# Altium project Vreg_Learning_Platform.PrjPcb (part 2 of 4)

## Sheet Input.SchDoc: <Project Name>
size A3; ApprovedBy: <Appr.>; Author: <Author>; CompanyName: Infineon Technologies AG; Engineer: <Rel.>; Organization: Infineon Technologies AG; Address1: IFAG DES S PS; Address2: Am Campeon 1-12  -  85579 Neubiberg  -  Germany; Address3: 85579 Neubiberg; Address4: Germany; DocumentNumber: 3; Revision: <Rev.>; SheetNumber: 3; SheetTotal: 9; Release: RC00; PageSetup: Record=PageOptions|CenterHorizontal=True|CenterVertical=True|PrintScale=1.01|XCorrection=1.00|YCorrection=1.00|PrintKind=0|BorderSize=5000000|LeftOffset=0|BottomOffset=0|Orientation=2|PaperLength=1000|PaperWidth=1000|Scale=100|PaperSource=7|PrintQuality=-4|MediaType=1|DitherType=10|PaperKind=A3|PrintScaleMode=1; Doc_ConfidentialStatus: <Doc_ConfidentialStatus>; Doc_Preliminary: <Doc_Preliminary>
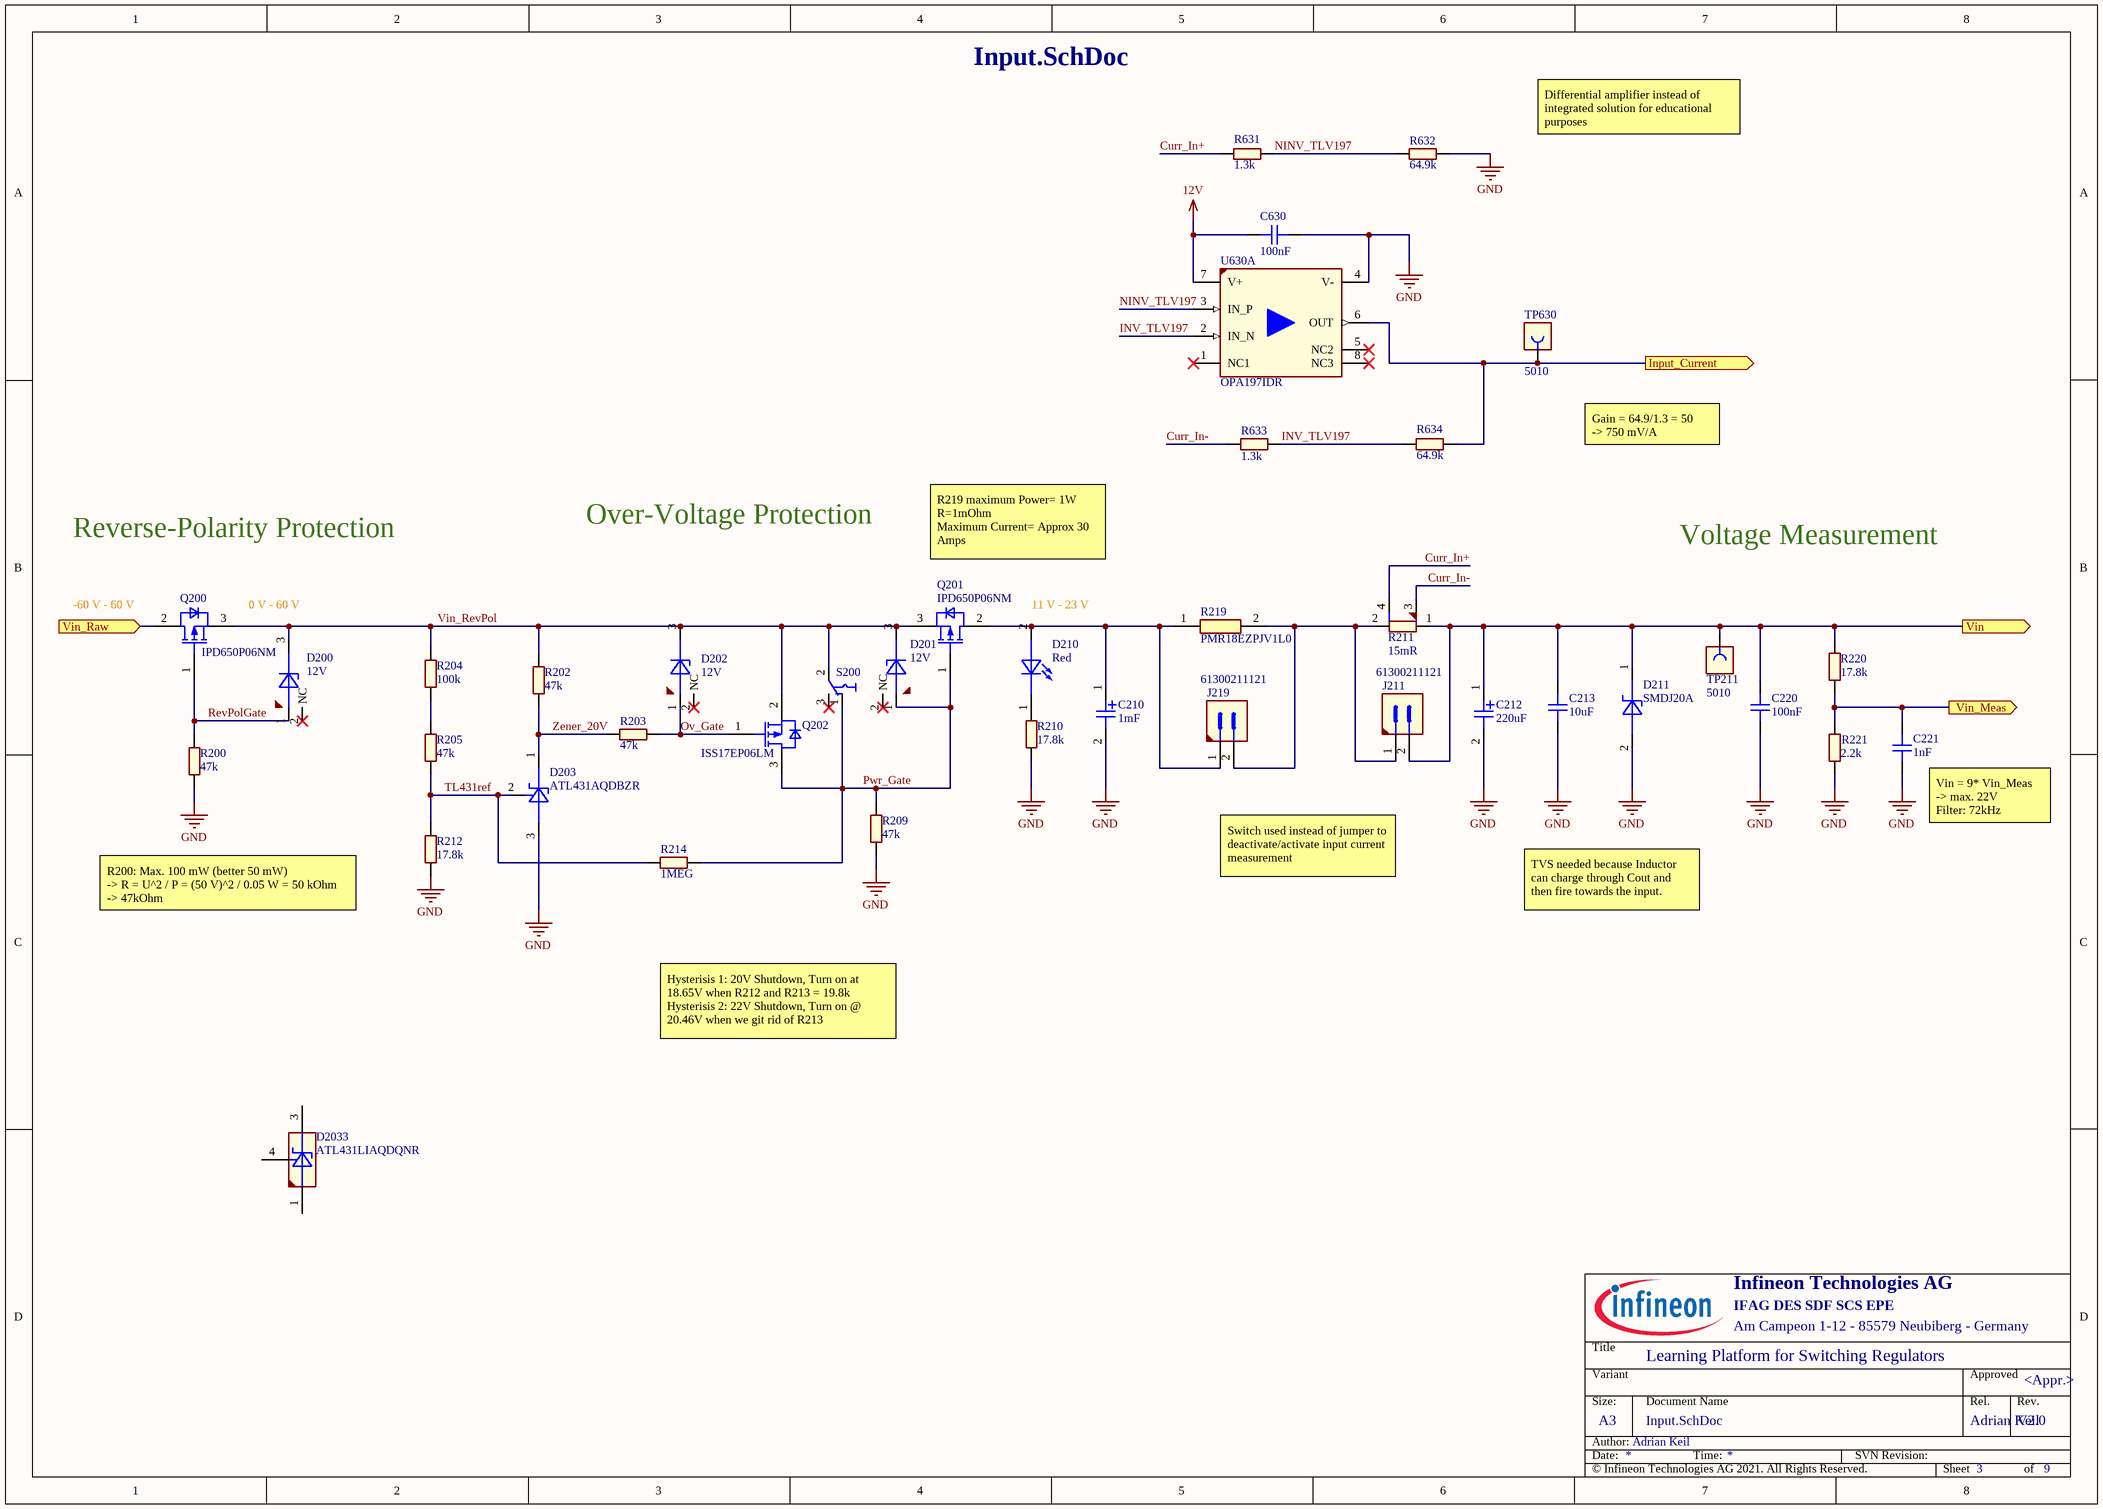
[diagram p1: Input.SchDoc]

### Parts
C210  1mF  [CAPPRD500W60D1300H2700B]
C212  220uF  [CAPAE1030X1050N-3]
C213  10uF  [CAPC3216X190N-1]
C220  100nF  [CAPC3216X125N-0]
C221  1nF  [CAPC3216X95N]
C630  100nF  [CAPC3216X125N-0]
D200  12V  [SOT95P230X110-3N]
D201  12V  [SOT95P230X110-3N]
D202  12V  [SOT95P230X110-3N]
D203  ATL431AQDBZR  [SOT95P237X112-3N-1]
D210  Red  [LEDSC160X80X80-2N-1]
D211  SMDJ20A  [DIOM7959X262N]
D2033  ATL431LIAQDQNR  [TI-SMD-X2SON-V]
J211  61300211121  [CON-M-THT-61300211121]
J219  61300211121  [CON-M-THT-61300211121]
Q200  IPD650P06NM  [TO228P998X250-3N-V2]
Q201  IPD650P06NM  [TO228P998X250-3N-V2]
Q202  ISS17EP06LM  [SOT95P240X110-3N-1-V]
R200  47k  [RESC3216X60N]
R202  47k  [RESC3216X60N]
R203  47k  [RESC3216X60N]
R204  100k  [RESC3216X60N]
R205  47k  [RESC3216X60N]
R209  47k  [RESC3216X60N]
R210  17.8k  [RESC3216X60N]
R211  15mR  [RES-SMD-L4T12]
R212  17.8k  [RESC3216X60N]
R214  1MEG  [RESC3216X60N]
R219  PMR18EZPJV1L0  [RESC3216X59N]
R220  17.8k  [RESC3216X60N]
R221  2.2k  [RESC3216X60N]
R631  1.3k  [RESC3216X60N]
R632  64.9k  [RESC3216X60N]
R633  1.3k  [RESC3216X60N]
R634  64.9k  [RESC3216X60N]
S200  CL-SB-12A-01T  [SW-SMD-CL-SB-12A-01T]  (value not drawn)
TP211  5010  [CON-THT-TP-5010]
TP630  5010  [CON-THT-TP-5010]
U630  OPA197IDR  [SOIC127P600X175-8N-23]  (part A of 2)

### Ports
Input_Current (out), Vin (out), Vin_Meas (out), Vin_Raw (in)

### Nets
12V: C630.2 U630.7(V+)
GND: C210.2 C212.2 C213.1 C220.2 C221.1 C630.1 D203.3(ANODE) D211.2(ANODE) R200.1 R209.1 R210.2 R212.2 R221.2 R632.2 U630.4(V-)
Curr_In+: R211.4(I2) R631.1
Curr_In-: R211.3(I1) R633.1
Input_Current: R634.2 TP630.1 U630.6(OUT) ; port Input_Current
INV_TLV197: R633.2 R634.1 U630.2(IN_N)
NINV_TLV197: R631.2 R632.1 U630.3(IN_P)
Ov_Gate: D202.1(ANODE) Q202.1(GATE) R203.1
Pwr_Gate: D201.1(ANODE) Q201.1(GATE) Q202.3(DRAIN) R209.2 R214.2 S200.1
RevPolGate: D200.1(ANODE) Q200.1(GATE) R200.2
TL431ref: D203.2(REF) R205.1 R212.1 R214.1
Vin: C212.1 C213.2 C220.1 D211.1(CATHODE) J211.2 R211.1(V1) R220.1 TP211.1 ; port Vin
Vin_Meas: C221.2 R220.2 R221.1 ; port Vin_Meas
Vin_RevPol: D200.3(CATHODE) D201.3(CATHODE) D202.3(CATHODE) Q200.3(SOURCE) Q201.3(SOURCE) Q202.2(SOURCE) R202.2 R204.1 S200.2
Zener_20V: D203.1(CATHODE) R202.1 R203.2
NetC210_1: C210.1 D210.2(Anode) J219.1 Q201.2(DRAIN) R219.1
NetD210_1: D210.1(Cathode) R210.1
NetJ211_1: J211.1 J219.2 R211.2(V2) R219.2
NetQ200_2: Q200.2(DRAIN) ; port Vin_Raw
NetR204_2: R204.2 R205.2

Not connected (* = marked no-connect by the designer): D200 2(NC)*; D201 2(NC)*; D202 2(NC)*; D2033 1(A) 2(NC) 3(C) 4(REF) 5(EP); S200 3*; U630 1(NC1)* 5(NC2)* 8(NC3)*

### Notes on the sheet
- Differential amplifier instead of integrated solution for educational purposes
- Gain = 64.9/1.3 = 50
  -> 750 mV/A
- Reverse-Polarity Protection
- Over-Voltage Protection
- R219 maximum Power= 1W
  R=1mOhm
  Maximum Current= Approx 30 Amps
- Voltage Measurement
- (near Q200) -60 V - 60 V
- 0 V - 60 V
- (near D210) 11 V - 23 V
- (near C221) Vin = 9* Vin_Meas
  -> max. 22V
  Filter: 72kHz
- R200: Max. 100 mW (better 50 mW)
  -> R = U^2 / P = (50 V)^2 / 0.05 W = 50 kOhm
  -> 47kOhm
- Switch used instead of jumper to deactivate/activate input current measurement
- TVS needed because Inductor can charge through Cout and then fire towards the input.
- Hysterisis 1: 20V Shutdown, Turn on at 18.65V when R212 and R213 = 19.8k
  Hysterisis 2: 22V Shutdown, Turn on @ 20.46V when we git rid of R213
- Title
- Variant
- Approved
- Date:
- Author:
- Size:
- A3
- Document Name
- Time:
- SVN Revision:
- Rel.
- Rev.
- Sheet
- of

### Library data of the parts
C210 = 646789: CAP / ELCO / 1mF / 35V / 20% / Aluminiumelectrolytic / -40°C to 105°C / 5.00mm C X 0.60mm W 13.00mm Dia X 27.00mm H / - / -; Multible Parts: No; Manufacturer: Kemet; Manufacturer Order Number: ESY108M035AL4AA; Symbol Type: Capacitor; Single; Polarized; 2 Pins; Pin 1 Positive; Alternate View: Yes; Article Number: 646789; Version Number: V01; Combined Parameters: TC:Aluminiumelectrolytic;Tol.:-20%/+20%;Vdc:35V; QuickPick: 1mF / 35V / 20% / Aluminiumelectrolytic / Radial; Type: Polarized; Style: Single; ComponentStatus: Released; PLMStatus: Active; Part Type: Capacitor; Value: 1mF; Tolerance Neg: 20%; Tolerance Pos: 20%; Application: Standard; Technology: Electrolytic; Temperature min: -40; Temperature max: 105; Temperature Range: Industrial; ROHS Compliant: Y; Automotive Qualified: No; PackageReference: Radial; ComponentLink1Description: Vendor WebSite; ComponentLink1URL: http://www.kemet.com; ComponentLink2Description: Datasheet; ComponentLink2URL: http://webnetprod.muc.infineon.com/PCBPortal_Prod/WorkFlows/AltiumComponent/StandardDocumentation?Versionid=646790; Supplier 1: Farnell; Supplier Part Number 1: 2835188; Supplier 2: DigiKey; Supplier Part Number 2: 399-6120-ND; Supplier 3: Mouser; Supplier Part Number 3: 80-ESY108M035AL4AA; Second Source allowed: Yes; Voltage DC (max): 35V; Package Description: Capacitor,polarized,Radial;5.00mm C X 0.60mm W 13.00mm Dia X 27.00mm H
C212 = 699376: CAP / ELCO / 220uF / 50V / 20% / Aluminiumelectrolytic / -55°C to 105°C / 10.30mm L X 10.30mm W X 10.50mm H / - / -; Multible Parts: No; Manufacturer: Nippon Chemi-Con; Manufacturer Order Number: EMZL500ARA221MJA0G; Symbol Type: Capacitor; Single; Polarized; 2 Pins; Pin 1 Positive; Alternate View: Yes; Article Number: 699376; Version Number: V00; Combined Parameters: TC:Aluminiumelectrolytic;Tol.:-20%/+20%;Vdc:50V; QuickPick: 220uF / 50V / 20% / Aluminiumelectrolytic / EMZL500ARA221MJA0G; Type: Polarized; Style: Single; Automotive Qualified: AEC Q200; ComponentStatus: Released; PLMStatus: Active; Part Type: Capacitor; Value: 220uF; Tolerance Neg: 20%; Tolerance Pos: 20%; Application: Standard; Technology: Electrolytic; Temperature min: -55; Temperature max: 105; Temperature Range: Military; ROHS Compliant: Y; PackageReference: EMZL500ARA221MJA0G; ComponentLink1Description: Vendor WebSite; ComponentLink1URL: http://www.chemi-con.co.jp/e/; ComponentLink2Description: Datasheet; ComponentLink2URL: http://webnetprod.muc.infineon.com/PCBPortal_Prod/WorkFlows/AltiumComponent/StandardDocumentation?Versionid=699377; Supplier 1: Farnell; Supplier 2: DigiKey; Supplier 3: Mouser; Supplier Part Number 3: 661-EMZL500ARA221MJA; Second Source allowed: Yes; Voltage DC (max): 50V; Package Description: Capacitor,Aluminum Electrolytic;10.30mm L X 10.30mm W X 10.50mm H
C213 = 648992: CAP / CERA / 10uF / 50V / 20% / X5R (EIA) / -55°C to 85°C / 1206 (3216) / SMD / -; Multiple Parts: No; Manufacturer: Taiyo Yuden; Manufacturer Order Number: UMK316BBJ106ML-T; Symbol Type: Capacitor; Single; Standard; 2 Pins; Alternate View: Yes; Article Number: 648992; Version Number: V00; Combined Parameters: TC:X5R (EIA);Tol.:-20%/+20%;Vdc:50V; QuickPick: 10uF / 50V / 20% / X5R (EIA) / 1206 (3216); Type: Standard; Style: Single; ComponentStatus: Released; PLMStatus: Active; Part Type: Capacitor; Value: 10uF; Tolerance Neg: 20%; Tolerance Pos: 20%; Application: Standard; Technology: Ceramic; Temperature min: -55; Temperature max: 85; Temperature Range: Military; ROHS Compliant: Y; Automotive Qualified: No; PackageReference: 1206 (3216); ComponentLink1Description: Vendor WebSite; ComponentLink1URL: http://www.yuden.co.jp/or/product/; ComponentLink2Description: Datasheet; ComponentLink2URL: http://webnetprod.muc.infineon.com/PCBPortal_Prod/WorkFlows/AltiumComponent/StandardDocumentation?Versionid=648993; Supplier 1: Farnell; Supplier Part Number 1: 2779059; Supplier 2: DigiKey; Supplier Part Number 2: 587-3248-1-ND; Supplier 3: Mouser; Supplier Part Number 3: 963-UMK316BBJ106ML-T; Second Source allowed: Yes; Voltage DC (max): 50V; Package Description: Capacitor,non-polarized,Chip;3.20mm L X 1.60mm W X 1.90mm H
C220 C630 = 282874: CAP / CERA / 100nF / 50V / 10% / X7R (EIA) / -55°C to 125°C / 1206(3216) / SMD / -; Multiple Parts: No; Legacy PartNumber: CAP01005660; Manufacturer: MuRata; Manufacturer Order Number: GRM31MR71H104KA01; Symbol Type: Capacitor; Single; Standard; 2 Pins; Alternate View: Yes; Article Number: 282874; Version Number: V01; Combined Parameters: TC:X7R (EIA);Tol.:-10%/+10%;Vdc:50V; QuickPick: 100nF / 50V / 10% / X7R (EIA) / 1206 (3216); Type: Standard; Style: Single; Package Metric: 3216; Package Imperial: 1206; ComponentStatus: Released; PLMStatus: Obsolete; Legacy DeviceID: CAP01005660; Part Type: Capacitor; Value: 100nF; Tolerance Neg: 10%; Tolerance Pos: 10%; Application: Standard; Technology: Ceramic; Temperature min: -55; Temperature max: 125; Temperature Range: Military; ROHS Compliant: Y; Automotive Qualified: No; PackageReference: 1206 (3216); ComponentLink1Description: Vendor WebSite; ComponentLink1URL: http://www.murata.com/; ComponentLink2Description: Datasheet; ComponentLink2URL: http://webnetprod.muc.infineon.com/PCBPortal_Prod/WorkFlows/AltiumComponent/StandardDocumentation?Versionid=282875; Supplier 1: Farnell; Supplier 2: DigiKey; Supplier 3: Mouser; Second Source allowed: Yes; Voltage DC (max): 50V; Package Description: Capacitor,non-polarized,Chip;3.20mm L X 1.60mm W X 1.25mm H
C221 = 280698: CAP / CERA / 1nF / 50V / 10% / X7R (EIA) / -55°C to 125°C / 1206(3216) / SMD / -; Multiple Parts: No; Legacy PartNumber: CAP01005183; Manufacturer: MuRata; Manufacturer Order Number: GRM319R71H102KA01; Symbol Type: Capacitor; Single; Standard; 2 Pins; Alternate View: Yes; Article Number: 280698; Version Number: V01; Combined Parameters: TC:X7R (EIA);Tol.:-10%/+10%;Vdc:50V; QuickPick: 1nF / 50V / 10% / X7R (EIA) / 1206 (3216); Type: Standard; Style: Single; Package Metric: 3216; Package Imperial: 1206; ComponentStatus: Released; PLMStatus: Obsolete; Legacy DeviceID: CAP01005183; Part Type: Capacitor; Value: 1nF; Tolerance Neg: 10%; Tolerance Pos: 10%; Application: Standard; Technology: Ceramic; Temperature min: -55; Temperature max: 125; Temperature Range: Military; ROHS Compliant: Y; Automotive Qualified: No; PackageReference: 1206 (3216); ComponentLink1Description: Vendor WebSite; ComponentLink1URL: http://www.murata.com/; ComponentLink2Description: Datasheet; ComponentLink2URL: http://webnetprod.muc.infineon.com/PCBPortal_Prod/WorkFlows/AltiumComponent/StandardDocumentation?Versionid=280699; Supplier 1: Farnell; Supplier 2: DigiKey; Supplier 3: Mouser; Second Source allowed: Yes; Voltage DC (max): 50V; Package Description: Capacitor,non-polarized,Chip;3.20mm L X 1.60mm W X 0.95mm H
D200-D202 = 659605: Voltage regulator diodes; Multiple Parts: No; Manufacturer: Nexperia; Manufacturer Order Number: BZX84-C12,215; Symbol Type: Standard Zener Diode, 3 Pins, 1 Anode, 2 Not Connected, 3 Cathode; Alternate View: Yes; Article Number: 659605; Version Number: V00; Combined Parameters: Vf:900mV;If:10mA;Ur:8V;Ir:100nA;Pmax:250mW; QuickPick: Zener Diode / SOT-23; Type: Zener Diode; Style: Single; Automotive Qualified: AEC Q101; ComponentStatus: Released; PLMStatus: Active; Voltage DC (max): na; Part Type: Diode; Value: 12V; Application: Standard; Temperature min: -65; Temperature max: 150; Temperature Range: Military; ROHS Compliant: Y; PackageReference: SOT-23; ComponentLink1Description: Vendor WebSite; ComponentLink1URL: http://www.nexperia.com; ComponentLink2Description: Datasheet; ComponentLink2URL: http://webnetprod.muc.infineon.com/PCBPortal_Prod/WorkFlows/AltiumComponent/StandardDocumentation?Versionid=659606; Supplier 1: Farnell; Supplier Part Number 1: 1081407; Supplier 2: DigiKey; Supplier Part Number 2: 1727-2936-1-ND; Supplier 3: Mouser; Supplier Part Number 3: 771-BZX84-C12-T/R; Second Source allowed: Yes; Package Description: SOT,0.95mm,pitch;3 pin,1.30mm W X 2.90mm L X 1.10mm H body
D203 = 644060: ATL431 Adjustable Precision Shunt Regulator; Manufacturer: Texas Instruments; Symbol type: TVS Diode Symbol, 1 Cathode, 2 Reference , 3 Anode; Article Number: 644060; Version Number: V01; Legacy DeviceID: TI_ATL431AQDBZR; Combined Parameters: - -;Vdc min/max:-;Iout:-;Fmax:-; QuickPick: SOT23-3 (DBZ); Automotive Qualified: No; ComponentStatus: Released; PLMStatus: Active; Second Source allowed: Yes; Voltage DC (max): na; Part Type: Integrated Circuit; Manufacturer Order Number: ATL431AQDBZR; Value: ATL431AQDBZR; Temperature min: -40; Temperature max: 125; Temperature Range: Automotive; ROHS Compliant: Y; PackageReference: SOT23-3 (DBZ); ComponentLink1Description: Vendor WebSite; ComponentLink1URL: http://www.ti.com; ComponentLink2Description: Datasheet; ComponentLink2URL: http://webnetprod.muc.infineon.com/PCBPortal_Prod/WorkFlows/AltiumComponent/StandardDocumentation?Versionid=644061; Supplier 1: Farnell; Supplier 2: DigiKey; Supplier Part Number 2: 296-47201-1-ND; Supplier 3: Mouser; Supplier Part Number 3: 595-ATL431AQDBZR; Package Description: SOT,0.95mm pitch;3 pin,1.30mm W X 2.92mm L X 1.12mm H body
D210 = 625459: WL-SMCW SMT Mono-color Chip LED Waterclear, Red,630nm; Manufacturer: Wurth Elektronik; Manufacturer Order Number: 150060RS75000; Symbol Type: Standard LED Symbol, 1 Cathode, 2 Anode; Article Number: 625459; Version Number: V01; Combined Parameters: Vf:2.4V;If:30mA;Ur:5V;Ir:10uA;Pmax:72mW; QuickPick: LED / 1608 (0603); Style: Single; Automotive Qualified: No; ComponentStatus: Released; PLMStatus: Active; Second Source allowed: Yes; Voltage DC (max): na; Part Type: Diode; Value: Red; Type: LED; Application: Standard; Temperature min: -40; Temperature max: 85; Temperature Range: Industrial; ROHS Compliant: Y; PackageReference: 1608 (0603); ComponentLink1Description: Vendor WebSite; ComponentLink1URL: http://www.we-online.com; ComponentLink2Description: Datasheet; ComponentLink2URL: http://webnetprod.muc.infineon.com/PCBPortal_Prod/WorkFlows/AltiumComponent/StandardDocumentation?Versionid=625460; Supplier 1: Farnell; Supplier Part Number 1: 2322071; Supplier 2: DigiKey; Supplier Part Number 2: 732-4978-1-ND; Supplier 3: Mouser; Supplier Part Number 3: 710-150060RS75000; Package Description: LED,Side Concave; 2 pin,1.60mm W X 0.80mm L X 0.80mm H
D211 = 646382: TVS Diode, Low Profile Package, Built in Strain Relief, Glass Passivated Chip Junction; Manufacturer: Littelfuse; Symbol Type: Transient Voltage Suppressor Diode (TVS, TAZ), 1 Cathode, 2 Anode; Article Number: 646382; Version Number: V01; Combined Parameters: Vf:5V;If:-;Ur:20V;Ir:2uA;Pmax:6.5W; QuickPick: TVS Diode / DO-214AB; Style: Single; Automotive Qualified: No; ComponentStatus: Released; PLMStatus: Active; Second Source allowed: Yes; Voltage DC (max): na; Part Type: Diode; Manufacturer Order Number: SMDJ20A; Value: SMDJ20A; Type: TVS Diode; Application: Standard; Temperature min: -65; Temperature max: 150; Temperature Range: Military; ROHS Compliant: Y; PackageReference: DO-214AB; ComponentLink1Description: Vendor WebSite; ComponentLink1URL: http://www.littelfuse.com/; ComponentLink2Description: Datasheet; ComponentLink2URL: http://webnetprod.muc.infineon.com/PCBPortal_Prod/WorkFlows/AltiumComponent/StandardDocumentation?Versionid=646383; Supplier 1: Farnell; Supplier Part Number 1: 2777300; Supplier 2: DigiKey; Supplier Part Number 2: SMDJ20ACT-ND; Supplier 3: Mouser; Supplier Part Number 3: 576-SMDJ20A; Package Description: Diode,Molded Body;7.94mm L X 5.905mm W X 2.62mm H
D2033 = 699359: High Bandwidth Low-Iq Programmable Shunt Regulator; Multiple Parts: No; Manufacturer: Texas Instruments; Alternate View: Yes; Article Number: 699359; Version Number: V00; Legacy DeviceID: TI_ATL431LIAQDQNR; Combined Parameters: - - -;Vo:2.5V to 36V; QuickPick: 2SON or SOT23-3; ComponentStatus: Released; PLMStatus: Active; Voltage DC (max): na; Symbol type: High Bandwidth Low-Iq Programmable Shunt Regulator; Part Type: Power Supply; Manufacturer Order Number: ATL431LIAQDQNR; Value: ATL431LIAQDQNR; Temperature min: -40; Temperature max: 125; Temperature Range: Automotive; ROHS Compliant: Y; Automotive Qualified: No; PackageReference: 2SON or SOT23-3; ComponentLink1Description: Vendor WebSite; ComponentLink1URL: http://www.ti.com; ComponentLink2Description: Datasheet; ComponentLink2URL: http://webnetprod.muc.infineon.com/PCBPortal_Prod/WorkFlows/AltiumComponent/StandardDocumentation?Versionid=699360; Supplier 1: Farnell; Supplier 2: DigiKey; Supplier Part Number 2: 296-ATL431LIAQDQNRCT-ND; Supplier 3: Mouser; Supplier Part Number 3: 595-ATL431LIAQDQNR; Second Source allowed: Yes; Package Description: X2SON, SMD, 5 pin, 1.00 mm L X 1.00 mm W X 0.40 mm H body
J211 J219 = 386760: Header, 2.54mm Pitch, 2 pin, Vertical, Single Row; Legacy PartNumber: CON01500943; Manufacturer: Wurth Elektronik; Alternat View: Yes; Article Number: 386760; Version Number: V01; Legacy DeviceID: WE_61300211121; Combined Parameters: Board-to-Board Header (male);2x1;Mounting:THT;Orient:0° (vertical);Shielded:No; QuickPick: 0° (vertical) / Board-to-Board; Style: Strip; Automotive Qualified: No; ComponentStatus: Released; PLMStatus: Active; Voltage DC (max): na; Part Type: Connector; Manufacturer Order Number: 61300211121; Value: 61300211121; Type: Board-to-Board; Temperature min: -40; Temperature max: 105; Temperature Range: Industrial; ROHS Compliant: Y; ComponentLink1Description: Vendor WebSite; ComponentLink1URL: http://www.we-online.com; ComponentLink2Description: Datasheet; ComponentLink2URL: http://webnetprod.muc.infineon.com/PCBPortal_Prod/WorkFlows/AltiumComponent/StandardDocumentation?Versionid=386761; Supplier 1: Farnell; Supplier Part Number 1: 2356153; Supplier 2: DigiKey; Supplier Part Number 2: 732-5315-ND; Supplier 3: Mouser; Supplier Part Number 3: 710-61300211121; Second Source allowed: Yes; Package Description: Header, Vertical, 2.54mm Pitch; 2 Pins, Single row, 5.08mm L X 2.54mm W X 8.89mm H body
Q200 Q201 = 644075: OptiMOS Power Transistor, -60 V; Manufacturer: Infineon Technologies; Symbol Type: Insulated-Gate Field-Effect Transistor (IGFET), P-Channel, Enhancement,  Body Diode, Pin 1 Gate, 2 Drain, 3 Source, 3 Pins; Article Number: 644075; Version Number: V01; Legacy DeviceID: IFX_IPD650P06NM; Combined Parameters: P-Channel Enhancement;Uds:-60V;Id:-22A;Rds:65R;P:83W; QuickPick: P-Channel Enhancement / 83W / -22A / -60V / PG-TO252-3-313; Type: P-Channel Enhancement; Style: Single; Automotive Qualified: No; ComponentStatus: Released; PLMStatus: Active; Second Source allowed: Yes; Voltage DC (max): na; Part Type: Transistor FET; Manufacturer Order Number: IPD650P06NM; Value: IPD650P06NM; Application: Power Electronics; Temperature min: -55; Temperature max: 175; Temperature Range: Military; ROHS Compliant: Y; PackageReference: PG-TO252-3-313; ComponentLink1Description: Vendor WebSite; ComponentLink1URL: https://www.infineon.com/; ComponentLink2Description: Datasheet; ComponentLink2URL: http://webnetprod.muc.infineon.com/PCBPortal_Prod/WorkFlows/AltiumComponent/StandardDocumentation?Versionid=644076; Supplier 1: Farnell; Supplier Part Number 1: 3267848; Supplier 2: DigiKey; Supplier Part Number 2: 448-IPD650P06NMATMA1CT-ND; Supplier 3: Mouser; Supplier Part Number 3: 726-IPD650P06NMATMA1; Package Description: TO,2.28mm pitch;2 pin,9.98mm L X 6.50mm W X 2.50mm H body
Q202 = 615536: OptiMOSTM Small Signal Transistor, -60 V; Manufacturer: Infineon Technologies; Symbol Type: Insulated-Gate Field-Effect Transistor (IGFET), P-Channel, Enhancement,  Body Diode, Pin 1 Gate, 2 Source, 3 Drain, 3 Pins; Article Number: 615536; Version Number: V01; Legacy DeviceID: IFX_ISS17EP06LM; Combined Parameters: P-Channel Enhancement;Uds:-60V;Id:-300mA;Rds:1.7R;P:360mW; QuickPick: P-Channel Enhancement / 360mW / -300mA / -60V / PG-SOT23-3-5; Type: P-Channel Enhancement; Style: Single; Automotive Qualified: No; ComponentStatus: Released; PLMStatus: Active; Second Source allowed: Yes; Voltage DC (max): na; Part Type: Transistor FET; Manufacturer Order Number: ISS17EP06LM; Value: ISS17EP06LM; Application: Small Signal; Temperature min: -55; Temperature max: 150; Temperature Range: Military; ROHS Compliant: Y; PackageReference: PG-SOT23-3-5; ComponentLink1Description: Vendor WebSite; ComponentLink1URL: https://www.infineon.com/; ComponentLink2Description: Datasheet; ComponentLink2URL: http://webnetprod.muc.infineon.com/PCBPortal_Prod/WorkFlows/AltiumComponent/StandardDocumentation?Versionid=615537; Supplier 1: Farnell; Supplier Part Number 1: 3267800; Supplier 2: DigiKey; Supplier Part Number 2: 448-ISS17EP06LMXTSA1CT-ND; Supplier 3: Mouser; Supplier Part Number 3: 726-ISS17EP06LMXTSA1; Package Description: SOT,0.95mm,pitch;3 pin,1.30mm W X 2.90mm L X 1.10mm H body
R200 R202 R203 R205 R209 = 354562: RES / STD / 47k / 250mW / 1% / 100ppm/K / -55°C to 155°C / 1206(3216) / SMD / -; Multiple Parts: No; Legacy PartNumber: RES01802933; Manufacturer: Vishay; Manufacturer Order Number: CRCW120647K0FK; Symbol Type: Resistor; Single; Standard; 2 Pins; Alternate View: Yes; Article Number: 354562; Version Number: V01; Combined Parameters: TCR:100ppm/K;Tol.:-1%/+1%;Vdc:200V;Idc:-;P:250mW; QuickPick: 47k / 1% / 0.25 / 1206 (3216); Style: Single; Automotive Qualified: AEC Q200; Package Metric: 3216; Package Imperial: 1206; ComponentStatus: Released; PLMStatus: Active; Voltage DC (max): 200V; Legacy DeviceID: RES01802933; Part Type: Resistor; Value: 47k; Tolerance Neg: 1%; Tolerance Pos: 1%; Type: Standard; Technology: Thick Film; Temperature min: -55; Temperature max: 155; Temperature Range: Military; ROHS Compliant: Y; PackageReference: 1206 (3216); ComponentLink1Description: Vendor WebSite; ComponentLink1URL: http://www.vishay.com; ComponentLink2Description: Datasheet; ComponentLink2URL: http://webnetprod.muc.infineon.com/PCBPortal_Prod/WorkFlows/AltiumComponent/StandardDocumentation?Versionid=354563; Supplier 1: Farnell; Supplier 2: DigiKey; Supplier 3: Mouser; Second Source allowed: Yes
R204 = 354752: RES / STD / 100k / 250mW / 1% / 100ppm/K / -55°C to 155°C / 1206(3216) / SMD / -; Multiple Parts: No; Legacy PartNumber: RES01802971; Manufacturer: Vishay; Manufacturer Order Number: CRCW1206100KFK; Symbol Type: Resistor; Single; Standard; 2 Pins; Alternate View: Yes; Article Number: 354752; Version Number: V01; Combined Parameters: TCR:100ppm/K;Tol.:-1%/+1%;Vdc:200V;Idc:-;P:250mW; QuickPick: 100k / 1% / 0.25 / 1206 (3216); Style: Single; Automotive Qualified: AEC Q200; Package Metric: 3216; Package Imperial: 1206; ComponentStatus: Released; PLMStatus: Active; Voltage DC (max): 200V; Legacy DeviceID: RES01802971; Part Type: Resistor; Value: 100k; Tolerance Neg: 1%; Tolerance Pos: 1%; Type: Standard; Technology: Thick Film; Temperature min: -55; Temperature max: 155; Temperature Range: Military; ROHS Compliant: Y; PackageReference: 1206 (3216); ComponentLink1Description: Vendor WebSite; ComponentLink1URL: http://www.vishay.com; ComponentLink2Description: Datasheet; ComponentLink2URL: http://webnetprod.muc.infineon.com/PCBPortal_Prod/WorkFlows/AltiumComponent/StandardDocumentation?Versionid=354753; Supplier 1: Farnell; Supplier 2: DigiKey; Supplier 3: Mouser; Second Source allowed: Yes
R210 R212 R220 = 354312: RES / STD / 17.8k / 250mW / 1% / 100ppm/K / -55°C to 155°C / 1206(3216) / SMD / -; Multiple Parts: No; Legacy PartNumber: RES01802883; Manufacturer: Vishay; Manufacturer Order Number: CRCW120617K8FK; Symbol Type: Resistor; Single; Standard; 2 Pins; Alternate View: Yes; Article Number: 354312; Version Number: V01; Combined Parameters: TCR:100ppm/K;Tol.:-1%/+1%;Vdc:200V;Idc:-;P:250mW; QuickPick: 17.8k / 1% / 0.25 / 1206 (3216); Style: Single; Automotive Qualified: AEC Q200; Package Metric: 3216; Package Imperial: 1206; ComponentStatus: Released; PLMStatus: Active; Voltage DC (max): 200V; Legacy DeviceID: RES01802883; Part Type: Resistor; Value: 17.8k; Tolerance Neg: 1%; Tolerance Pos: 1%; Type: Standard; Technology: Thick Film; Temperature min: -55; Temperature max: 155; Temperature Range: Military; ROHS Compliant: Y; PackageReference: 1206 (3216); ComponentLink1Description: Vendor WebSite; ComponentLink1URL: http://www.vishay.com; ComponentLink2Description: Datasheet; ComponentLink2URL: http://webnetprod.muc.infineon.com/PCBPortal_Prod/WorkFlows/AltiumComponent/StandardDocumentation?Versionid=354313; Supplier 1: Farnell; Supplier 2: DigiKey; Supplier 3: Mouser; Second Source allowed: Yes
R211 = 644055: RES / STD / 15mR / 500mW / 1% / 75ppm/K / -55°C to 155°C / 1206 (3216) / SMD / -; Multiple Parts: No; Manufacturer: Ohmite; Manufacturer Order Number: L4T12FR015FER; Symbol Type: Resistor; 4-Terminal (Shunt); Standard; 4 Pins; Alternate View: Yes; Article Number: 644055; Version Number: V01; Combined Parameters: TCR:75ppm/K;Tol.:-1%/+1%;Vdc:-;Idc:-;P:500mW; QuickPick: 15mR / 1% / 0.5 / 1206 (3216); Style: 4-Terminal (Shunt); ComponentStatus: Released; PLMStatus: Active; Part Type: Resistor; Value: 15mR; Tolerance Neg: 1%; Tolerance Pos: 1%; Type: Standard; Application: Precision; Technology: Thick Film; Temperature min: -55; Temperature max: 155; Temperature Range: Military; ROHS Compliant: Y; Automotive Qualified: No; PackageReference: 1206 (3216); ComponentLink1Description: Vendor WebSite; ComponentLink1URL: http://www.ohmite.com; ComponentLink2Description: Datasheet; ComponentLink2URL: http://webnetprod.muc.infineon.com/PCBPortal_Prod/WorkFlows/AltiumComponent/StandardDocumentation?Versionid=644056; Supplier 1: Farnell; Supplier Part Number 1: 3274221; Supplier 2: DigiKey; Supplier Part Number 2: 273-L4T12FR015FERCT-ND; Supplier 3: Mouser; Supplier Part Number 3: 284-L4T12FR015FER; Second Source allowed: Yes; Package Description: Resistor, SMD, 4 pin, 3.00 mm L X 1.60 mm W X 0.65 mm H body
R214 = 355322: RES / STD / 1MEG / 250mW / 1% / 100ppm/K / -55°C to 155°C / 1206(3216) / SMD / -; Multiple Parts: No; Legacy PartNumber: RES01803085; Manufacturer: Vishay; Manufacturer Order Number: CRCW12061M00FK; Symbol Type: Resistor; Single; Standard; 2 Pins; Alternate View: Yes; Article Number: 355322; Version Number: V01; Combined Parameters: TCR:100ppm/K;Tol.:-1%/+1%;Vdc:200V;Idc:-;P:250mW; QuickPick: 1MEG / 1% / 0.25 / 1206 (3216); Style: Single; Automotive Qualified: AEC Q200; Package Metric: 3216; Package Imperial: 1206; ComponentStatus: Released; PLMStatus: Active; Voltage DC (max): 200V; Legacy DeviceID: RES01803085; Part Type: Resistor; Value: 1MEG; Tolerance Neg: 1%; Tolerance Pos: 1%; Type: Standard; Technology: Thick Film; Temperature min: -55; Temperature max: 155; Temperature Range: Military; ROHS Compliant: Y; PackageReference: 1206 (3216); ComponentLink1Description: Vendor WebSite; ComponentLink1URL: http://www.vishay.com; ComponentLink2Description: Datasheet; ComponentLink2URL: http://webnetprod.muc.infineon.com/PCBPortal_Prod/WorkFlows/AltiumComponent/StandardDocumentation?Versionid=355323; Supplier 1: Farnell; Supplier 2: DigiKey; Supplier 3: Mouser; Second Source allowed: Yes
R219 = PMR18EZPJV1L0: Resistor; Manufacturer_Name: ROHM Semiconductor; Datasheet Link: https://www.mouser.cn/datasheet/2/348/pmr_e-1919321.pdf; Height: 0.59mm; Manufacturer_Part_Number: PMR18EZPJV1L0; Mouser Part Number: 755-PMR18EZPJV1L0; Mouser Price/Stock: https://www.mouser.co.uk/ProductDetail/ROHM-Semiconductor/PMR18EZPJV1L0?qs=MyNHzdoqoQKLzWdQPR00Ww%3D%3D
R221 = 353792: RES / STD / 2.2k / 250mW / 1% / 100ppm/K / -55°C to 155°C / 1206(3216) / SMD / -; Multiple Parts: No; Legacy PartNumber: RES01802779; Manufacturer: Vishay; Manufacturer Order Number: CRCW12062K20FK; Symbol Type: Resistor; Single; Standard; 2 Pins; Alternate View: Yes; Article Number: 353792; Version Number: V01; Combined Parameters: TCR:100ppm/K;Tol.:-1%/+1%;Vdc:200V;Idc:-;P:250mW; QuickPick: 2.2k / 1% / 0.25 / 1206 (3216); Style: Single; Automotive Qualified: AEC Q200; Package Metric: 3216; Package Imperial: 1206; ComponentStatus: Released; PLMStatus: Active; Voltage DC (max): 200V; Legacy DeviceID: RES01802779; Part Type: Resistor; Value: 2.2k; Tolerance Neg: 1%; Tolerance Pos: 1%; Type: Standard; Technology: Thick Film; Temperature min: -55; Temperature max: 155; Temperature Range: Military; ROHS Compliant: Y; PackageReference: 1206 (3216); ComponentLink1Description: Vendor WebSite; ComponentLink1URL: http://www.vishay.com; ComponentLink2Description: Datasheet; ComponentLink2URL: http://webnetprod.muc.infineon.com/PCBPortal_Prod/WorkFlows/AltiumComponent/StandardDocumentation?Versionid=353793; Supplier 1: Farnell; Supplier 2: DigiKey; Supplier 3: Mouser; Second Source allowed: Yes
R631 R633 = 353672: RES / STD / 1.3k / 250mW / 1% / 100ppm/K / -55°C to 155°C / 1206(3216) / SMD / -; Multiple Parts: No; Legacy PartNumber: RES01802755; Manufacturer: Vishay; Manufacturer Order Number: CRCW12061K30FK; Symbol Type: Resistor; Single; Standard; 2 Pins; Alternate View: Yes; Article Number: 353672; Version Number: V01; Combined Parameters: TCR:100ppm/K;Tol.:-1%/+1%;Vdc:200V;Idc:-;P:250mW; QuickPick: 1.3k / 1% / 0.25 / 1206 (3216); Style: Single; Automotive Qualified: AEC Q200; Package Metric: 3216; Package Imperial: 1206; ComponentStatus: Released; PLMStatus: Active; Voltage DC (max): 200V; Legacy DeviceID: RES01802755; Part Type: Resistor; Value: 1.3k; Tolerance Neg: 1%; Tolerance Pos: 1%; Type: Standard; Technology: Thick Film; Temperature min: -55; Temperature max: 155; Temperature Range: Military; ROHS Compliant: Y; PackageReference: 1206 (3216); ComponentLink1Description: Vendor WebSite; ComponentLink1URL: http://www.vishay.com; ComponentLink2Description: Datasheet; ComponentLink2URL: http://webnetprod.muc.infineon.com/PCBPortal_Prod/WorkFlows/AltiumComponent/StandardDocumentation?Versionid=353673; Supplier 1: Farnell; Supplier 2: DigiKey; Supplier 3: Mouser; Second Source allowed: Yes
R632 R634 = 354647: RES / STD / 64.9k / 250mW / 1% / 100ppm/K / -55°C to 155°C / 1206(3216) / SMD / -; Multiple Parts: No; Legacy PartNumber: RES01802950; Manufacturer: Vishay; Manufacturer Order Number: CRCW120664K9FK; Symbol Type: Resistor; Single; Standard; 2 Pins; Alternate View: Yes; Article Number: 354647; Version Number: V01; Combined Parameters: TCR:100ppm/K;Tol.:-1%/+1%;Vdc:200V;Idc:-;P:250mW; QuickPick: 64.9k / 1% / 0.25 / 1206 (3216); Style: Single; Automotive Qualified: AEC Q200; Package Metric: 3216; Package Imperial: 1206; ComponentStatus: Released; PLMStatus: Active; Voltage DC (max): 200V; Legacy DeviceID: RES01802950; Part Type: Resistor; Value: 64.9k; Tolerance Neg: 1%; Tolerance Pos: 1%; Type: Standard; Technology: Thick Film; Temperature min: -55; Temperature max: 155; Temperature Range: Military; ROHS Compliant: Y; PackageReference: 1206 (3216); ComponentLink1Description: Vendor WebSite; ComponentLink1URL: http://www.vishay.com; ComponentLink2Description: Datasheet; ComponentLink2URL: http://webnetprod.muc.infineon.com/PCBPortal_Prod/WorkFlows/AltiumComponent/StandardDocumentation?Versionid=354648; Supplier 1: Farnell; Supplier 2: DigiKey; Supplier 3: Mouser; Second Source allowed: Yes
S200 = 650099: Slid Switch, 12V, 200mA; Manufacturer: NIDEC COPAL ELECTRONICS, Inc.; Symbol Type: Switch, 2 Change Over 1 3, 3 Pins; Article Number: 650099; Version Number: V00; Automotive Qualified: No; ComponentStatus: Released; PLMStatus: Active; Second Source allowed: Yes; Voltage DC (max): na; Part Type: Electro Mechanic; Manufacturer Order Number: CL-SB-12A-01T; Value: CL-SB-12A-01T; Application: Power; Temperature min: -40; Temperature max: 85; Temperature Range: Industrial; ROHS Compliant: Y; ComponentLink1Description: Vendor WebSite; ComponentLink1URL: www.copal-electronics.com/; ComponentLink2Description: Datasheet; ComponentLink2URL: http://webnetprod.muc.infineon.com/PCBPortal_Prod/WorkFlows/AltiumComponent/StandardDocumentation?Versionid=650100; Supplier 1: Farnell; Supplier Part Number 1: 2854744; Supplier 2: DigiKey; Supplier Part Number 2: 563-1314-1-ND; Supplier 3: Mouser; Supplier Part Number 3: 229-CL-SB-12A-01T; Package Description: Switch, SMD, 3 Pins, 3.50 mm W X 8.50 mm L X 6.10 mm H body
TP211 TP630 = 382400: PC Test Point-Multipurpose THT, Red; Multiple Parts: No; Legacy PartNumber: CON01500529; Manufacturer: Keystone Electronics Corp.; Symbol Type: Connector, 1 Lead, Female; Alternate View: Yes; Article Number: 382400; Version Number: V01; Legacy DeviceID: KEY_5010; Combined Parameters: Board-to-Cable None (onboard);1x1;Mounting:THT;Orient:0° (vertical);Shielded:No; QuickPick: 0° (vertical) / Board-to-Cable; Style: Not Applicable; ComponentStatus: Released; PLMStatus: Active; Voltage DC (max): na; Part Type: Connector; Manufacturer Order Number: 5010; Value: 5010; Type: Board-to-Cable; Application: Test; Temperature min: 0; Temperature max: 0; Temperature Range: Military; ROHS Compliant: Y; Automotive Qualified: No; ComponentLink1Description: Vendor WebSite; ComponentLink1URL: http://www.keyelco.com/; ComponentLink2Description: Datasheet; ComponentLink2URL: http://webnetprod.muc.infineon.com/PCBPortal_Prod/WorkFlows/AltiumComponent/StandardDocumentation?Versionid=382401; Supplier 1: Farnell; Supplier Part Number 1: 2301288; Supplier 2: DigiKey; Supplier Part Number 2: 36-5010-ND; Supplier 3: Mouser; Supplier Part Number 3: 534-5010; Second Source allowed: Yes; Package Description: Test Point, 1.78 mm Lead Width, Round, 3.17 mm Dia X 8.28 mm H body
U630 = 699374: Manufacturer: Texas Instruments; Symbol Type: High-Precision, Low-Noise, Rail-to-Rail Output, JFET Op Amp; Alternate View: Yes; Article Number: 699374; Version Number: V00; Legacy DeviceID: TI_OPA197IDR; Combined Parameters: Res.:-;Fmax:10MHz; QuickPick: Amplifier / SOIC; Automotive Qualified: No; ComponentStatus: Released; PLMStatus: Active; Voltage DC (max): na; Multiple Parts: Yes; Part Type: Analog Parts; Manufacturer Order Number: OPA197IDR; Value: OPA197IDR; Type: Amplifier; Application: Power Electronics; Temperature min: -40; Temperature max: 125; Temperature Range: Automotive; ROHS Compliant: Y; PackageReference: SOIC; ComponentLink1Description: Vendor WebSite; ComponentLink1URL: http://www.ti.com; ComponentLink2Description: Datasheet; ComponentLink2URL: http://webnetprod.muc.infineon.com/PCBPortal_Prod/WorkFlows/AltiumComponent/StandardDocumentation?Versionid=699375; Supplier 1: Farnell; Supplier Part Number 1: 3117357; Supplier 2: DigiKey; Supplier Part Number 2: 296-43866-1-ND; Supplier 3: Mouser; Supplier Part Number 3: 595-OPA197IDR; Second Source allowed: Yes; Package Description: SOIC,1.27mm pitch;8 pin,3.895mm W X 4.905mm L X 1.75mm H body